# EAGLE schematic ElectroChemPIC (EAGLE 7.2.0)
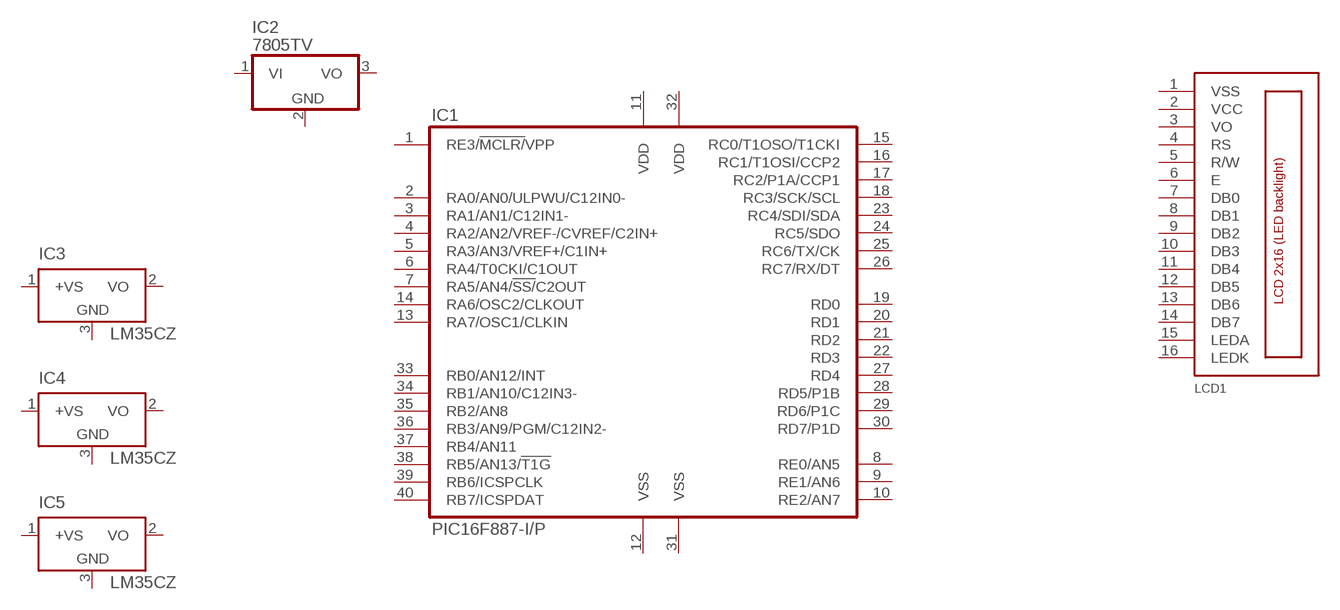
[diagram p0: schematic, sheet 1]

## Parts
IC1  PIC16F887-I/P  [DIL40]
IC2  7805TV  [TO220V]
IC3  LM35CZ  [TO92]
IC4  LM35CZ  [TO92]
IC5  LM35CZ  [TO92]
LCD1  LCD_2X16_SIL  [HY-1602F]
Unconnected: IC1.1(RE3/!MCLR/!VPP) IC1.2(RA0/AN0/ULPWU/C12IN0-) IC1.3(RA1/AN1/C12IN1-) IC1.4(RA2/AN2/VREF-/CVREF/C2IN+) IC1.5(RA3/AN3/VREF+/C1IN+) IC1.6(RA4/T0CKI/C1OUT) IC1.7(RA5/AN4/!SS/!C2OUT) IC1.8(RE0/AN5) IC1.9(RE1/AN6) IC1.10(RE2/AN7) IC1.13(RA7/OSC1/CLKIN) IC1.14(RA6/OSC2/CLKOUT) IC1.15(RC0/T1OSO/T1CKI) IC1.16(RC1/T1OSI/CCP2) IC1.17(RC2/P1A/CCP1) IC1.18(RC3/SCK/SCL) IC1.19(RD0) IC1.20(RD1) IC1.21(RD2) IC1.22(RD3) IC1.23(RC4/SDI/SDA) IC1.24(RC5/SDO) IC1.25(RC6/TX/CK) IC1.26(RC7/RX/DT) IC1.27(RD4) IC1.28(RD5/P1B) IC1.29(RD6/P1C) IC1.30(RD7/P1D) IC1.33(RB0/AN12/INT) IC1.34(RB1/AN10/C12IN3-) IC1.35(RB2/AN8) IC1.36(RB3/AN9/PGM/C12IN2-) IC1.37(RB4/AN11) IC1.38(RB5/AN13/!T1G) IC1.39(RB6/ICSPCLK) IC1.40(RB7/ICSPDAT) IC2.1(VI) IC2.2(GND) IC2.3(VO) IC3.1(+VS) IC3.2(VO) IC4.1(+VS) IC4.2(VO) IC5.1(+VS) IC5.2(VO) LCD1.3(VO) LCD1.4(RS) LCD1.5(R/W) LCD1.6(E) LCD1.7(DB0) LCD1.8(DB1) LCD1.9(DB2) LCD1.10(DB3) LCD1.11(DB4) LCD1.12(DB5) LCD1.13(DB6) LCD1.14(DB7) LCD1.15(LEDA) LCD1.16(LEDK)

## Power pins joined to a net without a drawn wire
GND: IC3.3(GND) IC4.3(GND) IC5.3(GND)
VCC: LCD1.2(VCC)
VDD: IC1.11(VDD) IC1.32(VDD)
VSS: IC1.12(VSS) IC1.31(VSS) LCD1.1(VSS)

## Library data of the parts
IC1 = microchip-pic16f887:PIC16F887: The library has been designed by Richard Magdycz <https://www.facebook.com/groups/eaglecadsoftUK>
IC2 = linear:78*: Positive VOLTAGE REGULATOR Source: http://cache.national.com/ds/LM/LM78L05.pdf http://www.fairchildsemi.com/ds/LM/LM7805.pdf
IC3-IC5 = lm35:LM35: Single-Supply Centigrade Temperature Sensor Vout = (10mV/°C x Temp °C) +5mmmV Source: http://www.national.com/ds/LM/LM35.pdf
LCD1 = lcd_2x16_HD44780_led_backlight:LCD_2X16_SIL